# EAGLE design reflow_oven (EAGLE 6.1)

## Sheet 1 of 3
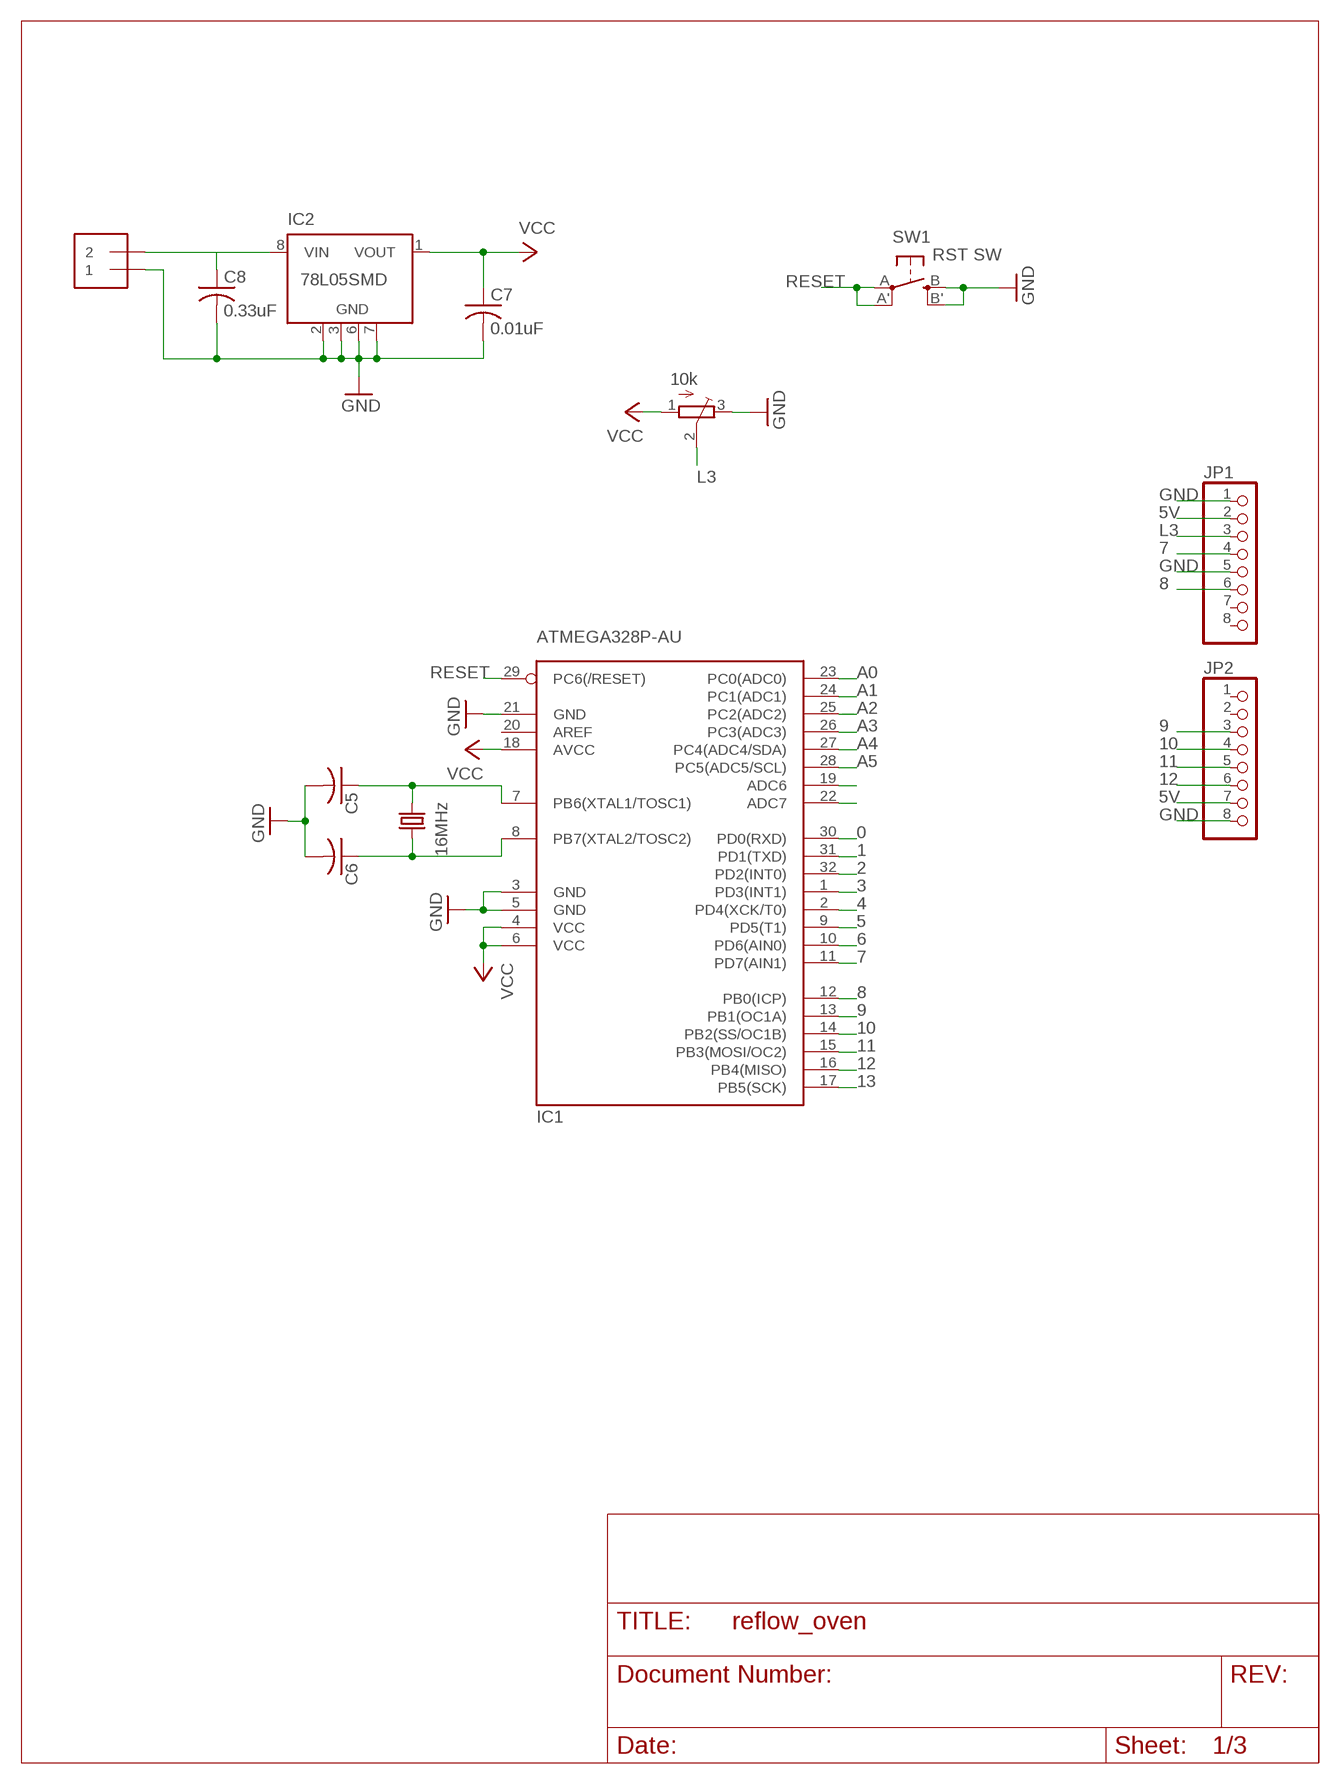
[diagram p0: schematic, sheet 1]

### Parts
C5  C-USC0603  [C0603]
C6  C-USC0603  [C0603]
C7  0.01uF  C-USC0603  [C0603]
C8  0.33uF  C-USC0603  [C0603]
IC1  MEGA8-AI  [TQFP32-08]
IC2  78L05SMD  [SO08]
J1  1X2-3.5MM  [1X2-3.5MM]
JP1  PINHD-1X8CLEANBIG  [1X08-CLEANBIG]
JP2  PINHD-1X8CLEANBIG  [1X08-CLEANBIG]
Q3  16MHz  CRYSTALSM49  [SM49]
SW1  RST SW  SPST_TACT-EVQQ2  [EVQ-Q2]
U$1  10k  TRIMPOTTC33X  [TC33X]

### Nets
0: IC1.30(PD0(RXD)) ; also sheet 2
1: IC1.31(PD1(TXD)) ; also sheet 2
2: IC1.32(PD2(INT0)) ; also sheet 3
3: IC1.1(PD3(INT1)) ; also sheet 3
4: IC1.2(PD4(XCK/T0))
5: IC1.9(PD5(T1))
5V: C7.1 IC1.4(VCC) IC1.6(VCC) IC1.18(AVCC) IC2.1(VOUT) JP1.2 JP2.7 U$1.1(A) ; supply symbol labelled VCC ; also sheet 2,3
6: IC1.10(PD6(AIN0))
7: IC1.11(PD7(AIN1)) JP1.4
8: IC1.12(PB0(ICP)) JP1.6
9: IC1.13(PB1(OC1A)) JP2.3
10: IC1.14(PB2(SS/OC1B)) JP2.4
11: IC1.15(PB3(MOSI/OC2)) JP2.5
12: IC1.16(PB4(MISO)) JP2.6
13: IC1.17(PB5(SCK))
A0: IC1.23(PC0(ADC0))
A1: IC1.24(PC1(ADC1))
A2: IC1.25(PC2(ADC2))
A3: IC1.26(PC3(ADC3))
A4: IC1.27(PC4(ADC4/SDA))
A5: IC1.28(PC5(ADC5/SCL))
GND: C5.2 C6.2 C7.2 C8.2 IC1.3(GND) IC1.5(GND) IC1.21(GND) IC2.2(GND) IC2.3(GND) IC2.6(GND) IC2.7(GND) J1.1 JP1.1 JP1.5 JP2.8 SW1.B'(S1) SW1.B(S) U$1.3(E) ; also sheet 2,3
L3: JP1.3 U$1.2(S)
N$9: IC1.19(ADC6)
N$10: IC1.22(ADC7)
PWRIN: C8.1 IC2.8(VIN) J1.2
RESET: IC1.29(PC6(/RESET)) SW1.A'(P1) SW1.A(P) ; also sheet 2
XTAL1: C5.1 IC1.7(PB6(XTAL1/TOSC1)) Q3.2
XTAL2: C6.1 IC1.8(PB7(XTAL2/TOSC2)) Q3.1
Unconnected: IC1.20(AREF) IC2.4(NC) IC2.5(NC) JP1.7 JP1.8 JP2.1 JP2.2

## Sheet 2 of 3
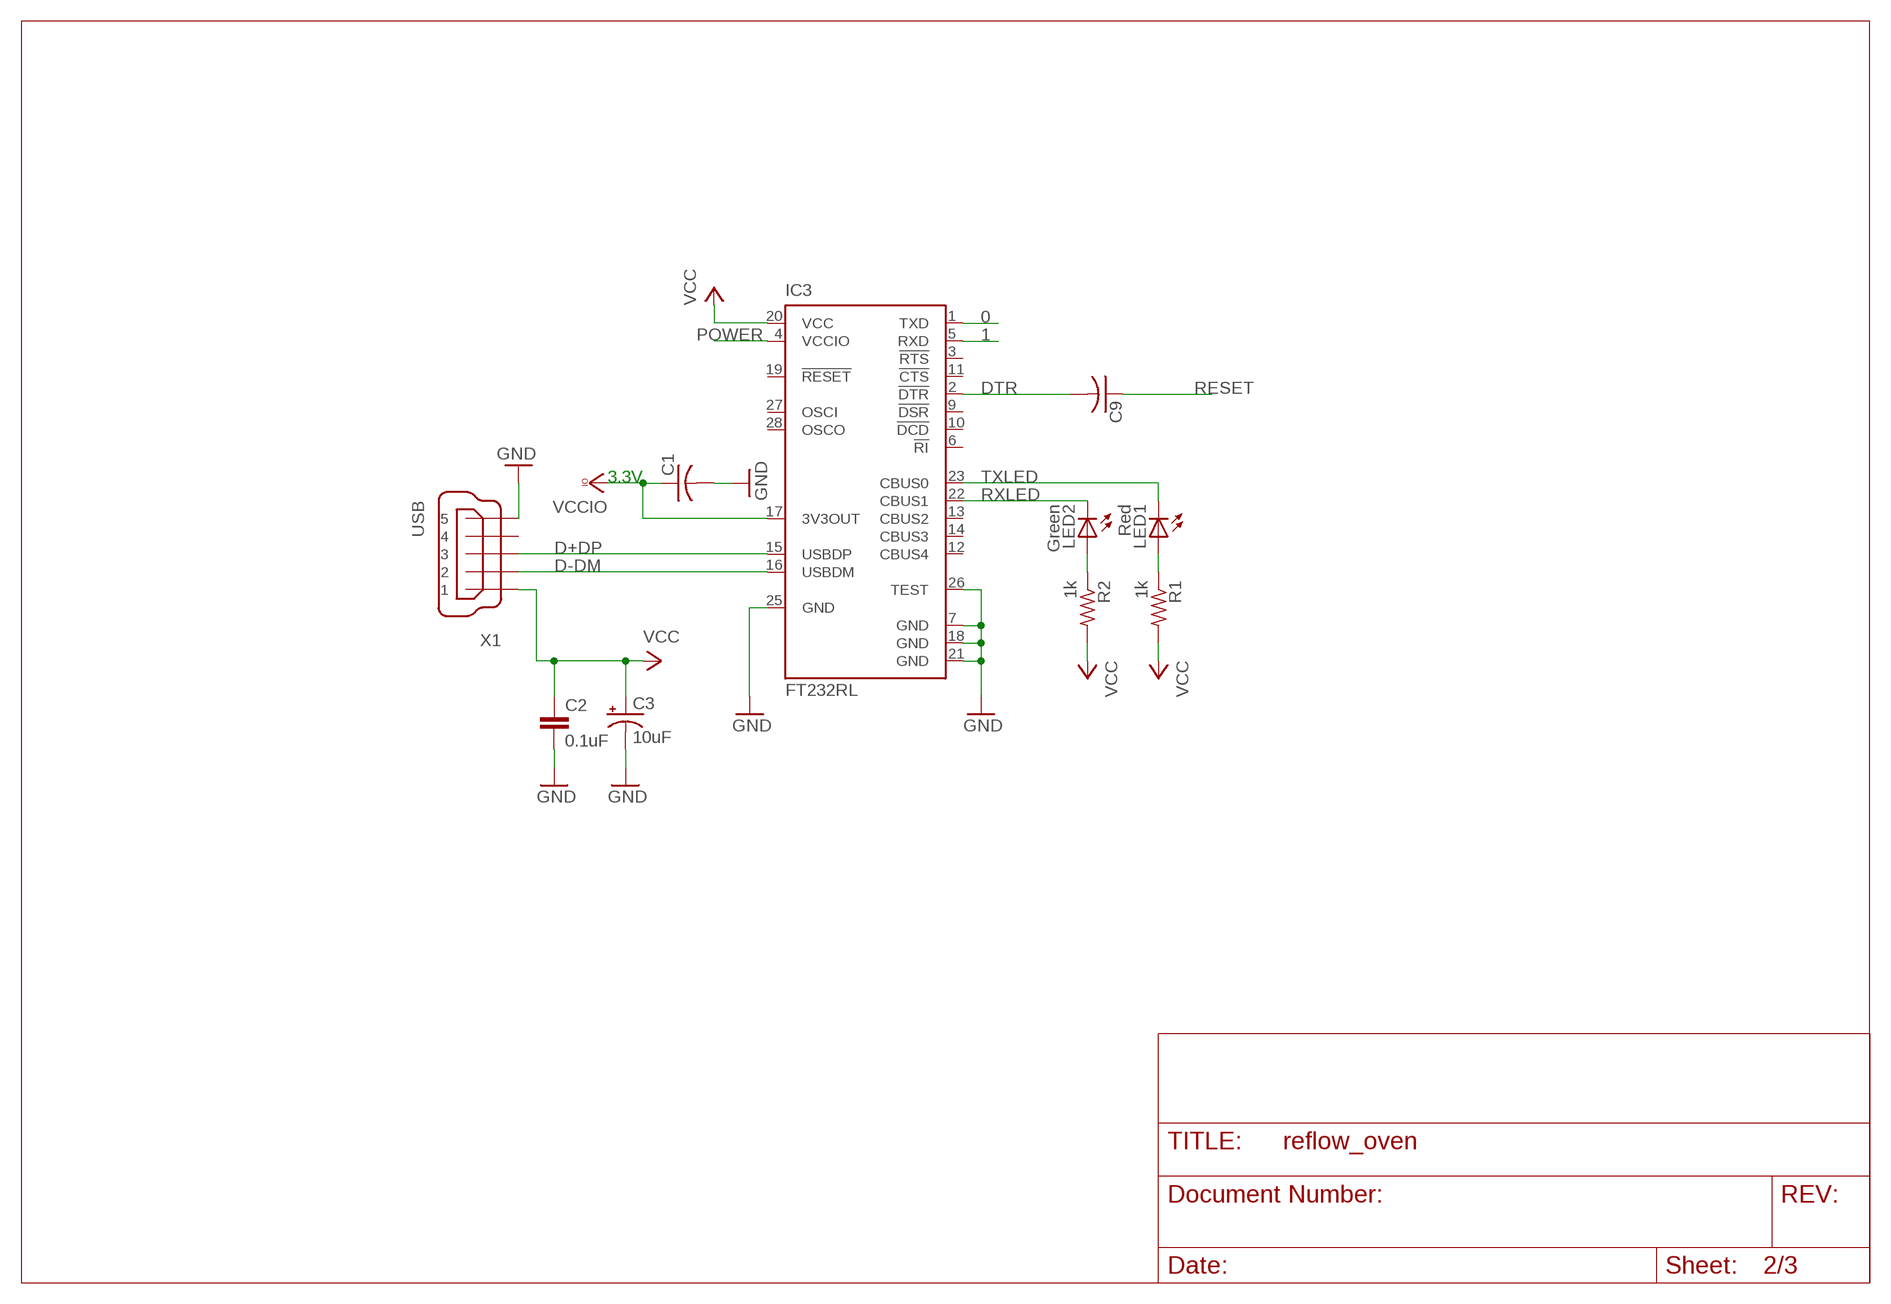
[diagram p1: schematic, sheet 2]

### Parts
C1  C-USC0603  [C0603]
C2  0.1uF  C-EUC0805  [C0805]
C3  10uF  CPOL-US175TMP-0810  [175TMP-0810]
C9  C-USC0603  [C0603]
IC3  FT232RL  [SSOP28]
LED1  Red  LEDCHIPLED_0603  [CHIPLED_0603]
LED2  Green  LEDCHIPLED_0603  [CHIPLED_0603]
R1  1k  R-US_R0603  [R0603]
R2  1k  R-US_R0603  [R0603]
X1  USB  MINI-USB-32005-201  [32005-201]

### Nets
0: IC3.1(TXD) ; also sheet 1
1: IC3.5(RXD) ; also sheet 1
5V: C2.1 C3.+ IC3.20(VCC) R1.2 R2.2 X1.1 ; supply symbol labelled VCC ; also sheet 1,3
D+DP: IC3.15(USBDP) X1.3
D-DM: IC3.16(USBDM) X1.2
DTR: C9.2 IC3.2(!DTR)
GND: C1.2 C2.2 C3.- IC3.7(GND) IC3.18(GND) IC3.21(GND) IC3.25(GND) IC3.26(TEST) X1.5 ; also sheet 1,3
N$3: LED2.A R2.1
N$4: LED1.A R1.1
POWER: IC3.4(VCCIO)
RESET: C9.1 ; also sheet 1
RXLED: IC3.22(CBUS1) LED2.C
TXLED: IC3.23(CBUS0) LED1.C
VCCIO: C1.1 IC3.17(3V3OUT)
Unconnected: IC3.3(!RTS) IC3.6(!RI) IC3.9(!DSR) IC3.10(!DCD) IC3.11(!CTS) IC3.12(CBUS4) IC3.13(CBUS2) IC3.14(CBUS3) IC3.19(!RESET) IC3.27(OSCI) IC3.28(OSCO) X1.4

### Notes on the sheet
- 3.3V

## Sheet 3 of 3: button debounce
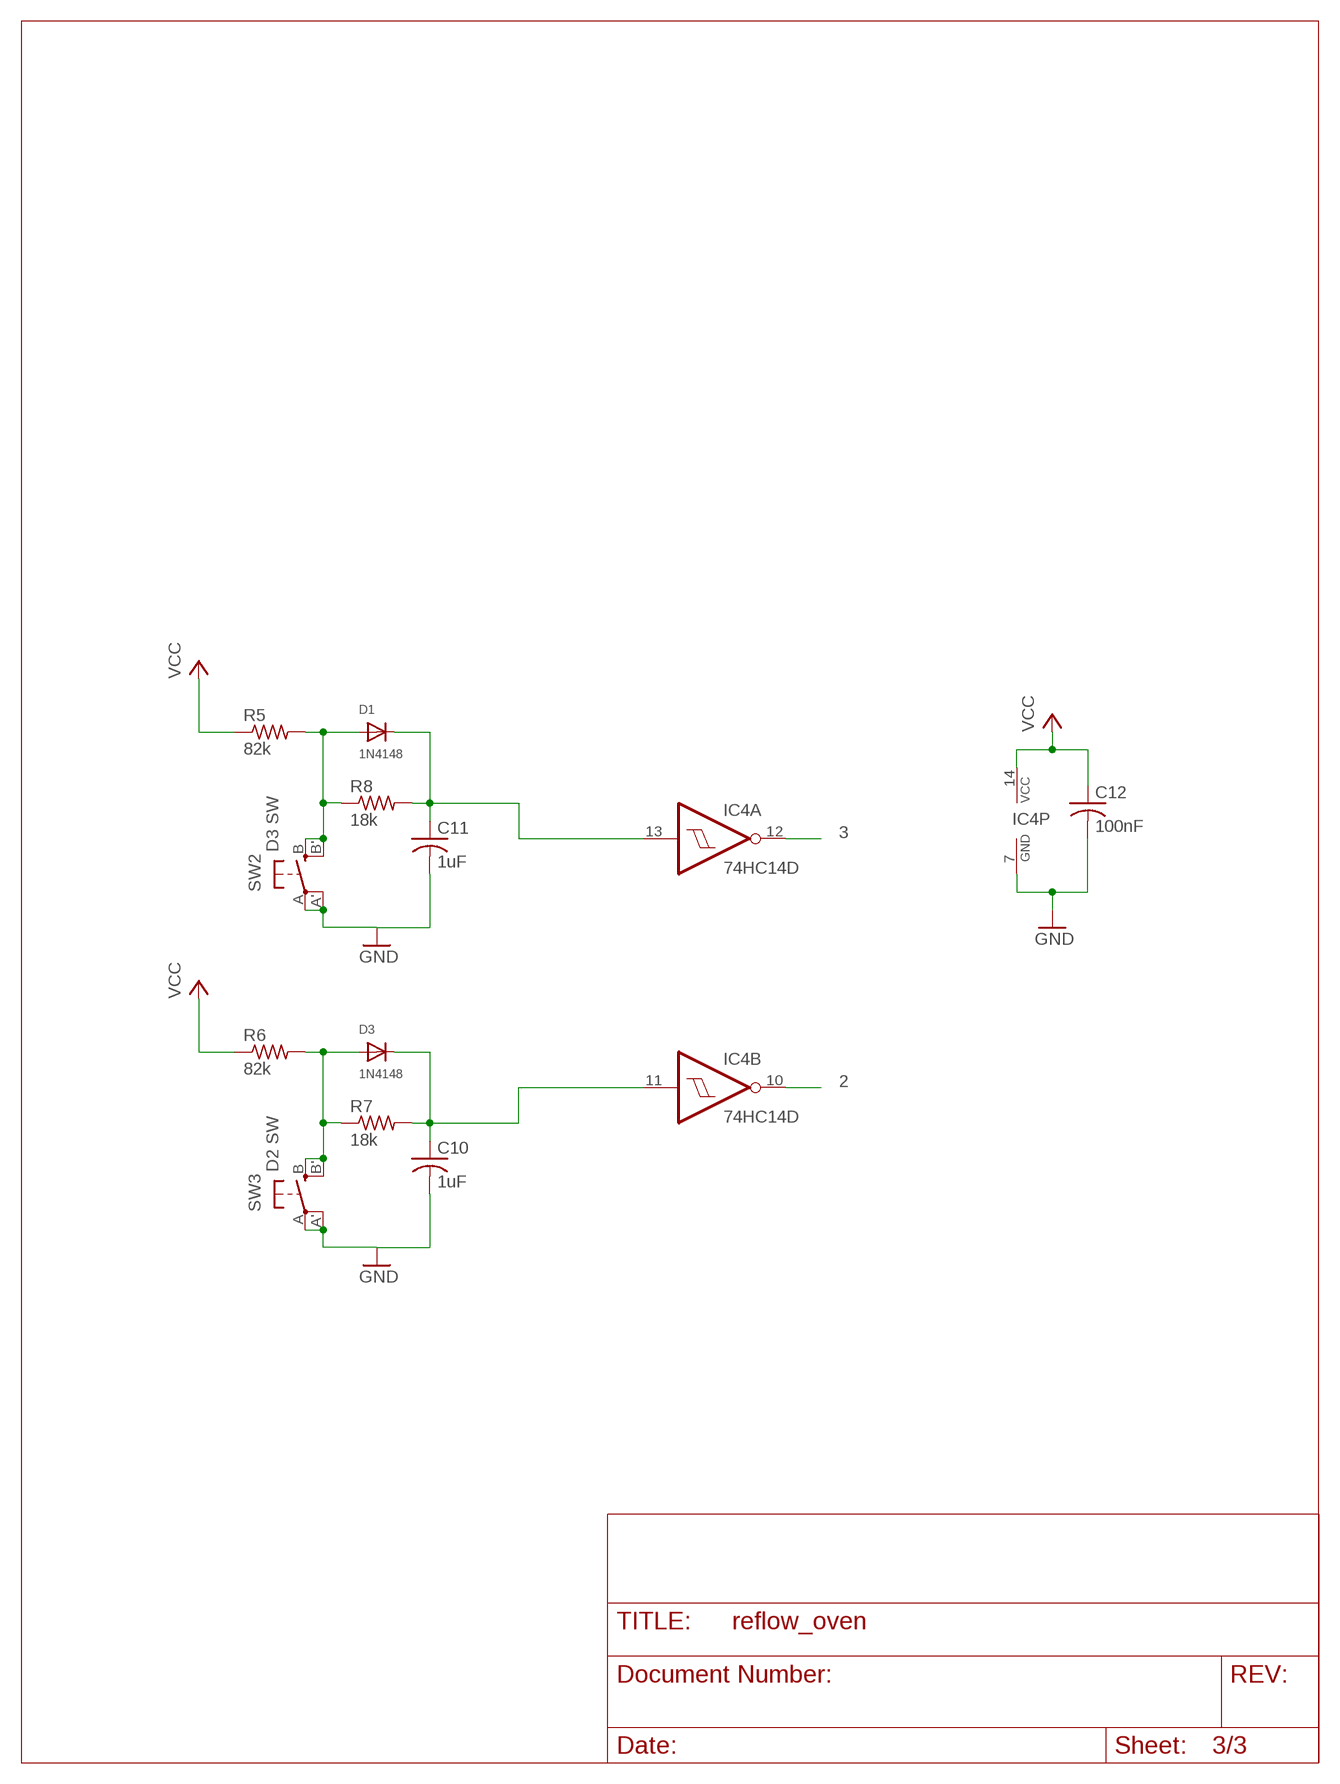
[diagram p2: schematic, sheet 3]

### Parts
C10  1uF  C-USC0805  [C0805]
C11  1uF  C-USC0805  [C0805]
C12  100nF  C-USC0805  [C0805]
D1  1N4148  DIODESOT23_REFLOW  [SOT23-R]
D3  1N4148  DIODESOT23_REFLOW  [SOT23-R]
IC4  74HC14D  [SO14]
R5  82k  R-US_R0805  [R0805]
R6  82k  R-US_R0805  [R0805]
R7  18k  R-US_R0805  [R0805]
R8  18k  R-US_R0805  [R0805]
SW2  D3 SW  SPST_TACT-EVQQ2  [EVQ-Q2]
SW3  D2 SW  SPST_TACT-EVQQ2  [EVQ-Q2]

### Nets
2: IC4.10(B:O) ; also sheet 1
3: IC4.12(A:O) ; also sheet 1
5V: C12.1 IC4.14(P:VCC) R5.1 R6.1 ; supply symbol labelled VCC ; also sheet 1,2
GND: C10.2 C11.2 C12.2 IC4.7(P:GND) SW2.A'(P1) SW2.A(P) SW3.A'(P1) SW3.A(P) ; also sheet 1,2
N$12: D1.1(A) R5.2 R8.1 SW2.B'(S1) SW2.B(S)
N$13: C11.1 D1.3(C) IC4.13(A:I) R8.2
N$14: D3.1(A) R6.2 R7.1 SW3.B'(S1) SW3.B(S)
N$15: C10.1 D3.3(C) IC4.11(B:I) R7.2
Unconnected: IC4.1(D:I) IC4.2(D:O) IC4.3(E:I) IC4.4(E:O) IC4.5(F:I) IC4.6(F:O) IC4.8(C:O) IC4.9(C:I)

## Library data of the parts
C1 C5-C9 = rcl:C-US: CAPACITOR, American symbol
C2 = rcl:C-EU: CAPACITOR, European symbol
C3 = adafruit:CPOL-US: POLARIZED CAPACITOR, American symbol
C10-C12 = resistor:C-US: CAPACITOR, American symbol
D1 D3 = adafruit:DIODE: Diode SMADIODE - SMA Surface Mount Package 20V 1A Schottky Diode Digikey: 641-1014-6-ND DO-1N4148 - Through Hole Small Current Diode SOD-123 20V 1 A (.5mV Vf) Schottky Diode - Digikey: MBRX120TPMSCT-ND SOD-323 10V 570mA (.38mV Vf, 3ns) Schottky Diode - Digikey: ZLLS410CT-ND SOD-523 30V 30mA Schottky Diode (RB751S-40TE61) - Digikey: RB751S-40TE61CT-ND SOT23-R/W - SOT23 Package (R = Solder Paste/Reflow Ovens, W = Hand-Soldering) BAT54Film 40V 300mA - Digikey: 497-7162-1-ND
IC1 = atmel:MEGA8: MICROCONTROLLER 8 Kbytes FLASH, 1 kbytes SRAM, 512 bytes EEPROM, USART, 6-channel 10 bit ADC, 2-channel 8 bit ADC Pin compatible with Atmega48, ATMega88, ATMega168 Source: avr.lbr; MF: Atmel; MPN: ATMEGA328P-AU; OC_FARNELL: 1715486; OC_NEWARK: 68T2935
IC2 = linear:78L*SMD: Positive VOLTAGE REGULATOR
IC3 = ftdichip:FT232R: Source: http://www.ftdichip.com/Documents/DataSheets/DS_FT232R_v104.pdf; MPN: FT232RL; OC_FARNELL: 1146032; OC_NEWARK: 91K9918
IC4 = 74xx-eu:74*14: Hex schmitt trigger INVERTER
J1 = adafruit:1X2: 3.5mm Terminal block http://www.ladyada.net/library/pcb/eaglelibrary.html
JP1 JP2 = adafruit:PINHD-1X8: PIN HEADER
LED1 LED2 = led:LED: LED OSRAM: - CHIPLED LG R971, LG N971, LY N971, LG Q971, LY Q971, LO R971, LY R971 LH N974, LH R974 LS Q976, LO Q976, LY Q976 LO Q996 - Hyper CHIPLED LW Q18S LB Q993, LB Q99A, LB R99A - SideLED LS A670, LO A670, LY A670, LG A670, LP A670 LB A673, LV A673, LT A673, LW A673 LH A674 LY A675 LS A676, LA A676, LO A676, LY A676, LW A676 LS A679, LY A679, LG A679 - Hyper Micro SIDELED® LS Y876, LA Y876, LO Y876, LY Y876 LT Y87S - SmartLED LW L88C, LW L88S LB L89C, LB L89S, LG L890 LS L89K, LO L89K, LY L89K LS L896, LA L896, LO L896, LY L896 - TOPLED LS T670, LO T670, LY T670, LG T670, LP T670 LSG T670, LSP T670, LSY T670, LOP T670, LYG T670 LG T671, LOG T671, LSG T671 LB T673, LV T673, LT T673, LW T673 LH T674 LS T676, LA T676, LO T676, LY T676, LB T676, LH T676, LSB T676, LW T676 LB T67C, LV T67C, LT T67C, LS T67K, LO T67K, LY T67K, LW E67C LS E67B, LA E67B, LO E67B, LY E67B, LB E67C, LV E67C, LT E67C LW T67C LS T679, LY T679, LG T679 LS T770, LO T770, LY T770, LG T770, LP T770 LB T773, LV T773, LT T773, LW T773 LH T774 LS E675, LA E675, LY E675, LS T675 LS T776, LA T776, LO T776, LY T776, LB T776 LHGB T686 LT T68C, LB T68C - Hyper Mini TOPLED® LB M676 - Mini TOPLED Santana® LG M470 LS M47K, LO M47K, LY M47K Source: http://www.osram.convergy.de LUXEON: - LUMILED® LXK2-PW12-R00, LXK2-PW12-S00, LXK2-PW14-U00, LXK2-PW14-V00 LXK2-PM12-R00, LXK2-PM12-S00, LXK2-PM14-U00 LXK2-PE12-Q00, LXK2-PE12-R00, LXK2-PE12-S00, LXK2-PE14-T00, LXK2-PE14-U00 LXK2-PB12-K00, LXK2-PB12-L00, LXK2-PB12-M00, LXK2-PB14-N00, LXK2-PB14-P00, LXK2-PB14-Q00 LXK2-PR12-L00, LXK2-PR12-M00, LXK2-PR14-Q00, LXK2-PR14-R00 LXK2-PD12-Q00, LXK2-PD12-R00, LXK2-PD12-S00 LXK2-PH12-R00, LXK2-PH12-S00 LXK2-PL12-P00, LXK2-PL12-Q00, LXK2-PL12-R00 Source: www.luxeon.com KINGBRIGHT: KA-3528ASYC Source: www.kingbright.com
Q3 = crystal:CRYSTAL: CRYSTAL; OC_FARNELL: unknown; OC_NEWARK: unknown
R1 R2 R5-R8 = resistor:R-US_: RESISTOR, American symbol
SW1-SW3 = adafruit:SPST_TACT: SMT 6mm switch, EVQQ2 series http://www.ladyada.net/library/eagle
U$1 = adafruit:TRIMPOT: SMT trimmer potentiometer part number TC33X http://www.ladyada.net/library/eagle
X1 = con-cypressindustries:MINI-USB-: MINI USB-B Conector Source: www.cypressindustries.com; OC_FARNELL: unknown; OC_NEWARK: unknown

## Board
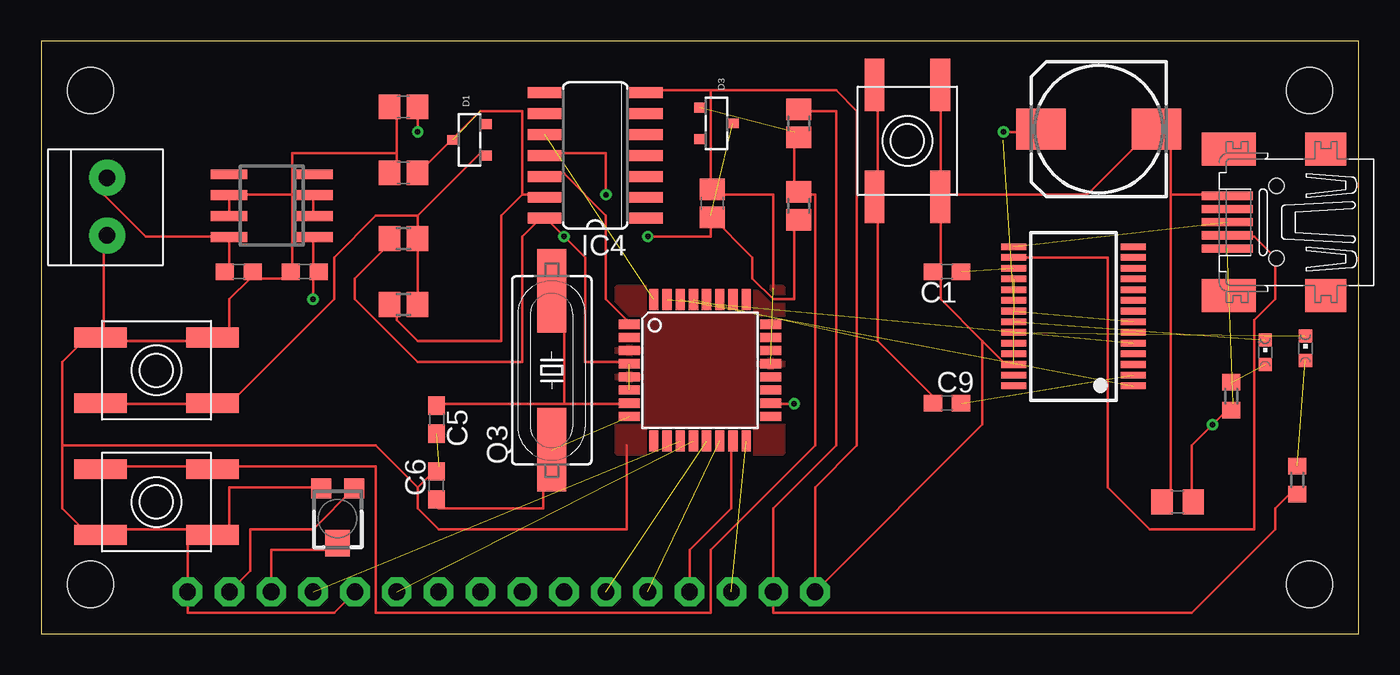
[diagram p3: board, top side]
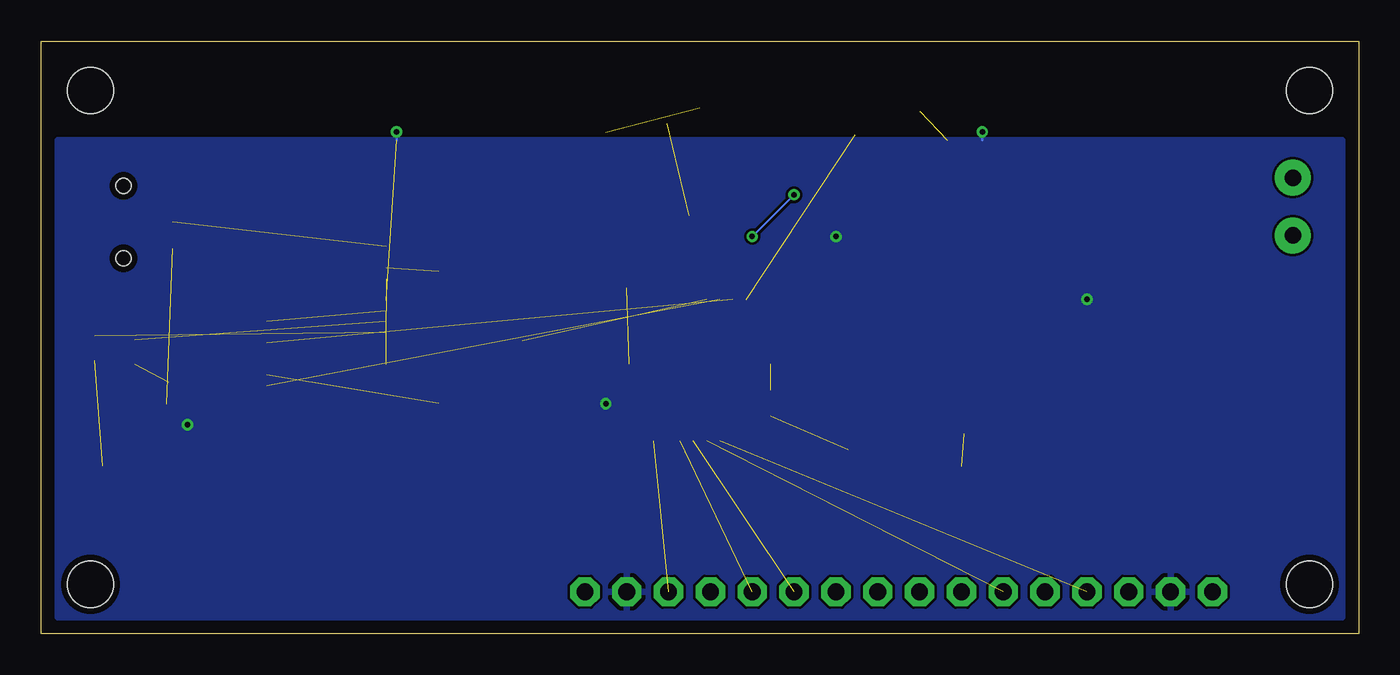
[diagram p4: board, bottom side, seen from below]

Size 80 x 36 mm. Coordinates in mm from the lower left corner, seen from the top.
Outline: 0,0 80,0 80,36 0,36 0,0
Copper layers (1*16): Top 0.0356mm / dielectric 1.5011mm / Bottom 0.0356mm
Design rules: minimum track width 6mil, minimum drill 13mil, track to track 6mil, track to pad 6mil, pad to pad 6mil, via to via 6mil, smd to smd 6mil, copper to edge 15mil, drill to drill 6mil, minimum pad ring 7mil, minimum via ring 7mil, stop-mask expansion 4mil, vias tented up to drill 0mil, thermal gap 10mil
Holes 2.8 mm at 3,33 77,33 3,3 77,3

### Footprints (pad centres in the part's own frame; a part is rotated, then mirrored left to right if it is on the bottom)
C0603 = smd 1.1 x 1: 1 -0.85,0; 2 0.85,0
C0805 = smd 1.3 x 1.5: 1 -0.95,0; 2 0.95,0
175TMP-0810 = smd 3 x 2.5: + 3.5,0; - -3.5,0
C0805' = smd 1.3 x 1.5: 1 -0.85,0; 2 0.85,0
SOT23-R = smd 0.6 x 0.7: 1 -0.95,-1; 2 0.95,-1; 3 0,1
TQFP32-08 = smd 1.27 x 0.559: 1 -4.293,2.8; 2 -4.293,2; 3 -4.293,1.2; 4 -4.293,0.4; 5 -4.293,-0.4; 6 -4.293,-1.2; 7 -4.293,-2; 8 -4.293,-2.8; 17 4.293,-2.8; 18 4.293,-2; 19 4.293,-1.2; 20 4.293,-0.4; 21 4.293,0.4; 22 4.293,1.2; 23 4.293,2; 24 4.293,2.8 | smd 0.559 x 1.27: 9 -2.8,-4.293; 10 -2,-4.293; 11 -1.2,-4.293; 12 -0.4,-4.293; 13 0.4,-4.293; 14 1.2,-4.293; 15 2,-4.293; 16 2.8,-4.293; 25 2.8,4.293; 26 2,4.293; 27 1.2,4.293; 28 0.4,4.293; 29 -0.4,4.293; 30 -1.2,4.293; 31 -2,4.293; 32 -2.8,4.293
SO08 = smd 0.6 x 2.2: 1 -1.905,-2.6; 2 -0.635,-2.6; 3 0.635,-2.6; 4 1.905,-2.6; 5 1.905,2.6; 6 0.635,2.6; 7 -0.635,2.6; 8 -1.905,2.6
SSOP28 = smd 0.4 x 1.5: 1 -4.225,-3.625; 2 -3.575,-3.625; 3 -2.925,-3.625; 4 -2.275,-3.625; 5 -1.625,-3.625; 6 -0.975,-3.625; 7 -0.325,-3.625; 8 0.325,-3.625; 9 0.975,-3.625; 10 1.625,-3.625; 11 2.275,-3.625; 12 2.925,-3.625; 13 3.575,-3.625; 14 4.225,-3.625; 15 4.225,3.625; 16 3.575,3.625; 17 2.925,3.625; 18 2.275,3.625; 19 1.625,3.625; 20 0.975,3.625; 21 0.325,3.625; 22 -0.325,3.625; 23 -0.975,3.625; 24 -1.625,3.625; 25 -2.275,3.625; 26 -2.925,3.625; 27 -3.575,3.625; 28 -4.225,3.625
SO14 = smd 0.66 x 2.032: 1 -3.81,-3.073; 2 -2.54,-3.073; 3 -1.27,-3.073; 4 0,-3.073; 5 1.27,-3.073; 6 2.54,-3.073; 7 3.81,-3.073; 8 3.81,3.073; 9 2.54,3.073; 10 1.27,3.073; 11 0,3.073; 12 -1.27,3.073; 13 -2.54,3.073; 14 -3.81,3.073
1X2-3.5MM = drill 1 pad 2.184: 1 1.8,0; 2 -1.7,0
1X08-CLEANBIG = drill 1.016 pad 1.778 octagon: 1 -8.89,0; 2 -6.35,0; 3 -3.81,0; 4 -1.27,0; 5 1.27,0; 6 3.81,0; 7 6.35,0; 8 8.89,0
CHIPLED_0603 = smd 0.8 x 0.8: A 0,-0.75; C 0,0.75
SM49 = smd 5.08 x 1.778: 1 -4.826,0; 2 4.826,0
R0603 = smd 1 x 1.1: 1 -0.85,0; 2 0.85,0
R0805 = smd 1.3 x 1.5: 1 -0.85,0; 2 0.85,0
EVQ-Q2 = smd 3.2 x 1.2: A -3.4,-2; A' 3.4,-2; B -3.4,2; B' 3.4,2
TC33X = smd 1.2 x 1.2: 1 -1,-1.825; 3 1,-1.825 | smd 1.5 x 1.6: 2 0,1.5
32005-201 = smd 3.1 x 0.5: 1 3,1.6; 2 3,0.8; 3 3,0; 4 3,-0.8; 5 3,-1.6 | smd 2.5 x 2: M1 -3,-4.45; M2 -3,4.45 | smd 3.3 x 2: M3 2.9,4.45; M4 2.9,-4.45 | hole 0.9: 0,2.2; 0,-2.2

### Placement (x,y rotation side)
C1  55,22 180 top
C2  69,8 180 top
C3  64.21,30.65 180 top
C5  24,13 270 top
C6  24,9 90 top
C7  16,22 180 top
C8  12,22 0 top
C9  55,14 0 top
C10  1uF  [C0805']  40.74,26.14 90 top
C11  1uF  [C0805']  22,28 180 top
C12  100nF  [C0805']  22,32 180 top
D1  26,30 90 top
D3  41,31 270 top
IC1  40,16 0 top
IC2  14,26 90 top
IC3  62.68,19.28 90 top
IC4  33.64,29.05 90 top
J1  4,26 270 top
JP1  17.78,2.54 0 top
JP2  38.1,2.54 0 top
LED1  76.76,17.34 0 top
LED2  74.31,17.1 0 top
Q3  31,16 90 top
R1  76.26,9.34 270 top
R2  72.26,14.42 270 top
R5  22,24 0 top
R6  46,31 270 top
R7  46,26 270 top
R8  22,20 180 top
SW1  52.59,29.94 270 top
SW2  7,16 180 top
SW3  7,8 0 top
U$1  18,7 180 top
X1  75,25 180 top

### Tracks (layer width: path | path; a pad name or v marks a point on that pad's centre or on a via)
0  (1 unrouted)
1  (1 unrouted)
2  (1 unrouted)
3
  Top 0.152: IC1.1 35.56,19.05 34.29,20.32 34.29,25.4 31.75,27.94 30.48,27.94 IC4.12
5V  (via drill 0.33)  (3 unrouted)
  Top 0.152: 30.48,25.4 v31.75,24.13 33.02,22.86 33.02,16.51 35.56,16.51 IC1.4 | 30.48,25.4 29.21,24.13 29.21,16.51 22.86,16.51 19.05,20.32 19.05,21.59 21.59,24.13 R5.1 | 30.48,25.4 IC4.14 | R2.2 72.39,13.97 v71.12,12.7 69.85,11.43 69.85,7.62 C2.1 | 16.51,21.59 16.51,24.13 IC2.1 | R1.2 76.2,8.89 74.93,7.62 74.93,6.35 69.85,1.27 44.45,1.27 JP2.7 44.45,7.62 48.26,11.43 48.26,31.75 45.72,31.75 R6.1 | JP1.2 12.7,3.81 12.7,6.35 16.51,6.35 19.05,8.89 U$1.1 | v45.72,13.97 44.45,13.97 IC1.18 | v22.86,30.48 22.86,31.75 C12.1 | v16.51,20.32 16.51,21.59 | 16.51,21.59 C7.1 | v58.42,30.48 59.69,30.48 C3.+
  Bottom 0.152: v22.86,30.48 22.86,30 | v58.42,30.48 58.42,30
  pour Bottom: 1,1 79,1 79,30 1,30
7  (1 unrouted)
8  (1 unrouted)
9  (1 unrouted)
10  (1 unrouted)
11
  Top 0.152: JP2.5 39.37,5.08 41.91,7.62 41.91,11.43 IC1.15
12  (1 unrouted)
D+DP  (1 unrouted)
D-DM
  Top 0.152: IC3.16 59.69,22.86 64.77,22.86 64.77,8.89 67.31,6.35 73.66,6.35 73.66,19.05 74.93,20.32 74.93,22.86 73.66,24.13 72.39,24.13 X1.2
DTR  (1 unrouted)
GND  (6 unrouted)
  Top 0.152: 68.58,26.67 68.58,30.48 C3.- 67.31,30.48 63.5,26.67 54.61,26.67 | 68.58,26.67 68.58,7.62 C2.2 | 68.58,26.67 71.12,26.67 X1.5 | 54.61,21.59 54.61,25.4 SW1.B' 54.61,26.67 | 57.15,17.78 54.61,20.32 54.61,21.59 | 57.15,17.78 58.42,16.51 IC3.26 | 54.61,21.59 C1.2 | 54.61,26.67 54.61,33.02 SW1.B | 57.15,17.78 57.15,12.7 JP2.8 46.99,8.89 49.53,11.43 49.53,31.75 48.26,33.02 40.64,33.02 | 22.86,8.89 24.13,10.16 C6.2 | 22.86,8.89 22.86,7.62 24.13,6.35 35.56,6.35 35.56,11.43 | 40.64,26.67 44.45,26.67 44.45,21 | 40.64,33.02 36.83,33.02 IC4.7 | 40.64,26.67 40.64,33.02 | 40.64,26.67 C10.2 | U$1.3 16.51,8.89 11.43,8.89 11.43,6.35 SW3.A' | 8.89,6.35 10.16,6.35 SW3.A' | 8.89,6.35 3.81,6.35 SW3.A 2.54,6.35 1.27,7.62 1.27,11.43 | 8.89,6.35 JP1.1 8.89,1.27 17.78,1.27 JP1.5 | 8.89,6.35 SW3.A' | 3.81,17.78 3.81,24.13 J1.1 | 15.24,21.59 12.7,21.59 | 12.7,21.59 11.43,20.32 11.43,17.78 SW2.A 10.16,17.78 3.81,17.78 | 12.7,21.59 C8.2 | 21.59,29.21 21.59,31.75 C12.2 | 21.59,29.21 21.59,27.94 C11.2 | 11.43,26.67 11.43,25.4 IC2.7 | 16.51,26.67 16.51,25.4 IC2.2 | 16.51,26.67 15.24,26.67 | 15.24,26.67 11.43,26.67 | 11.43,26.67 IC2.6 | 16.51,26.67 IC2.3 | 21.59,29.21 15.24,29.21 15.24,26.67 | 15.24,26.67 15.24,21.59 | 15.24,21.59 C7.2 | 3.81,17.78 SW2.A' 2.54,17.78 1.27,16.51 1.27,11.43 | 22.86,8.89 20.32,11.43 1.27,11.43
  pour Top: 35,21 45,21 45,11 35,11
L3
  Top 0.152: JP1.3 13.97,5.08 17.78,5.08 U$1.2
N$3  (1 unrouted)
N$4  (1 unrouted)
N$12
  Top 0.152: SW2.B' 3.81,13.97 10.16,13.97 SW2.B 11.43,13.97 17.78,20.32 17.78,22.86 20.32,25.4 22.86,25.4 | 22.86,25.4 26.67,29.21 D1.1 | 22.86,24.13 22.86,25.4 | 22.86,24.13 22.86,20.32 R8.1 | 22.86,24.13 R5.2
N$13  (1 unrouted)
  Top 0.152: 29.21,26.67 27.94,25.4 27.94,17.78 22.86,17.78 21.59,19.05 21.59,20.32 R8.2 | 29.21,26.67 30.48,26.67 IC4.13 | 29.21,26.67 29.21,31.75 26.67,31.75 22.86,27.94 C11.1
N$14  (1 unrouted)
  Top 0.152: 45.72,26.67 45.72,30.48 R6.2 | 45.72,26.67 46.99,26.67 46.99,11.43 40.64,5.08 40.64,1.27 20.32,1.27 20.32,10.16 11.43,10.16 SW3.B' 10.16,10.16 3.81,10.16 SW3.B | 45.72,26.67 R7.1
N$15  (via drill 0.33)  (1 unrouted)
  Top 0.152: 40.64,25.4 43.18,22.86 43.18,21.59 44.45,20.32 45.72,20.32 45.72,25.4 R7.2 | v34.29,26.67 34.29,29.21 30.48,29.21 IC4.11 | v36.83,24.13 40.64,24.13 40.64,25.4 | 40.64,25.4 C10.1
  Bottom 0.152: v36.83,24.13 v34.29,26.67
PWRIN
  Top 0.152: 11.43,24.13 11.43,21.59 C8.1 | 11.43,24.13 6.35,24.13 3.81,26.67 J1.2 | 11.43,24.13 IC2.8
RESET  (1 unrouted)
  Top 0.152: C9.1 54.61,13.97 50.8,17.78 50.8,25.4 SW1.A' 50.8,26.67 50.8,33.02 SW1.A
RXLED  (1 unrouted)
TXLED  (1 unrouted)
VCCIO  (1 unrouted)
XTAL1
  Top 0.152: 31.75,13.97 35.56,13.97 IC1.7 | 31.75,13.97 24.13,13.97 C5.1 | 31.75,13.97 31.75,20.32 Q3.2
XTAL2  (1 unrouted)
  Top 0.152: C6.1 24.13,7.62 30.48,7.62 30.48,10.16 Q3.1